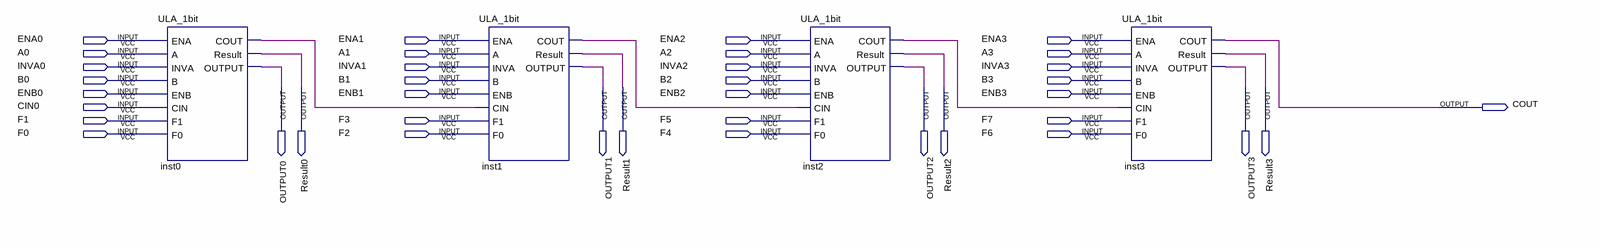
[diagram p0: schematic sheet]
// Quartus schematic ULA_4bit.bdf as structural Verilog: 4 symbols, 38 pins
module ULA_4bit (
  input  ENA0,
  input  ENA1,
  input  ENA2,
  input  ENA3,
  input  A0,
  input  A1,
  input  A2,
  input  A3,
  input  INVA0,
  input  INVA1,
  input  INVA2,
  input  INVA3,
  input  B0,
  input  B1,
  input  B2,
  input  B3,
  input  ENB0,
  input  ENB1,
  input  ENB2,
  input  ENB3,
  input  CIN0,
  input  F1,
  input  F3,
  input  F5,
  input  F7,
  input  F0,
  input  F2,
  input  F4,
  input  F6,
  output OUTPUT0,
  output Result0,
  output OUTPUT1,
  output Result1,
  output OUTPUT2,
  output Result2,
  output OUTPUT3,
  output Result3,
  output COUT
);

  wire inst0_cout, inst1_cout, inst2_cout;

  ULA_1bit inst0 (
    .ENA(ENA0), .A(A0), .INVA(INVA0), .B(B0), .ENB(ENB0), .CIN(CIN0), .F1(F1), .F0(F0), .COUT(inst0_cout),
    .Result(Result0), .OUTPUT(OUTPUT0));
  ULA_1bit inst1 (
    .ENA(ENA1), .A(A1), .INVA(INVA1), .B(B1), .ENB(ENB1), .CIN(inst0_cout), .F1(F3), .F0(F2),
    .COUT(inst1_cout), .Result(Result1), .OUTPUT(OUTPUT1));
  ULA_1bit inst2 (
    .ENA(ENA2), .A(A2), .INVA(INVA2), .B(B2), .ENB(ENB2), .CIN(inst1_cout), .F1(F5), .F0(F4),
    .COUT(inst2_cout), .Result(Result2), .OUTPUT(OUTPUT2));
  ULA_1bit inst3 (
    .ENA(ENA3), .A(A3), .INVA(INVA3), .B(B3), .ENB(ENB3), .CIN(inst2_cout), .F1(F7), .F0(F6), .COUT(COUT),
    .Result(Result3), .OUTPUT(OUTPUT3));
endmodule
